# Altium project iC-PN3924_MEZ.PrjPCB
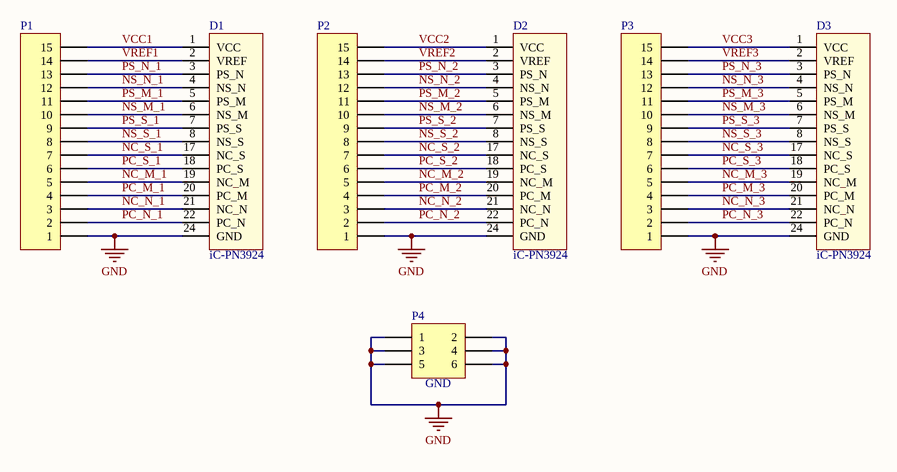
[diagram p0: Sheet1_MEZ.SchDoc]
1 sheet, 7 parts. Net scope: global (net labels, ports and power ports of the same name join across sheets).
Board file: PCB_MEZ.PcbDoc

## Sheet Sheet1_MEZ.SchDoc
size A4

### Parts
D1  iC-PN3924  [iC-PN3924]
D2  iC-PN3924  [iC-PN3924]
D3  iC-PN3924  [iC-PN3924]
P1  Header 15  [HDR1X15]  (value not drawn)
P2  Header 15  [HDR1X15]  (value not drawn)
P3  Header 15  [HDR1X15]  (value not drawn)
P4  GND  [HDR2X3]

### Nets
GND: D1.24(GND) D2.24(GND) D3.24(GND) P1.1 P2.1 P3.1 P4.1 P4.2 P4.3 P4.4 P4.5 P4.6
NC_M_1: D1.19(NC_M) P1.5
NC_M_2: D2.19(NC_M) P2.5
NC_M_3: D3.19(NC_M) P3.5
NC_N_1: D1.21(NC_N) P1.3
NC_N_2: D2.21(NC_N) P2.3
NC_N_3: D3.21(NC_N) P3.3
NC_S_1: D1.17(NC_S) P1.7
NC_S_2: D2.17(NC_S) P2.7
NC_S_3: D3.17(NC_S) P3.7
NS_M_1: D1.6(NS_M) P1.10
NS_M_2: D2.6(NS_M) P2.10
NS_M_3: D3.6(NS_M) P3.10
NS_N_1: D1.4(NS_N) P1.12
NS_N_2: D2.4(NS_N) P2.12
NS_N_3: D3.4(NS_N) P3.12
NS_S_1: D1.8(NS_S) P1.8
NS_S_2: D2.8(NS_S) P2.8
NS_S_3: D3.8(NS_S) P3.8
PC_M_1: D1.20(PC_M) P1.4
PC_M_2: D2.20(PC_M) P2.4
PC_M_3: D3.20(PC_M) P3.4
PC_N_1: D1.22(PC_N) P1.2
PC_N_2: D2.22(PC_N) P2.2
PC_N_3: D3.22(PC_N) P3.2
PC_S_1: D1.18(PC_S) P1.6
PC_S_2: D2.18(PC_S) P2.6
PC_S_3: D3.18(PC_S) P3.6
PS_M_1: D1.5(PS_M) P1.11
PS_M_2: D2.5(PS_M) P2.11
PS_M_3: D3.5(PS_M) P3.11
PS_N_1: D1.3(PS_N) P1.13
PS_N_2: D2.3(PS_N) P2.13
PS_N_3: D3.3(PS_N) P3.13
PS_S_1: D1.7(PS_S) P1.9
PS_S_2: D2.7(PS_S) P2.9
PS_S_3: D3.7(PS_S) P3.9
VCC1: D1.1(VCC) P1.15
VCC2: D2.1(VCC) P2.15
VCC3: D3.1(VCC) P3.15
VREF1: D1.2(VREF) P1.14
VREF2: D2.2(VREF) P2.14
VREF3: D3.2(VREF) P3.14

### Library data of the parts
P1-P3 = Header 15: Header, 15-Pin; LatestRevisionDate: 17-Jul-2002; LatestRevisionNote: Re-released for DXP Platform.; Publisher: Altium Limited
P4 = Header 3X2: Header, 3-Pin, Dual row; LatestRevisionDate: 17-Jul-2002; LatestRevisionNote: Re-released for DXP Platform.; Publisher: Altium Limited